# Altium project CHEM_CONTROL_BOX.PrjPcb (part 2 of 3)

## Sheet MCU.SchDoc
size D; SheetNumber: 3; SheetTotal: 7
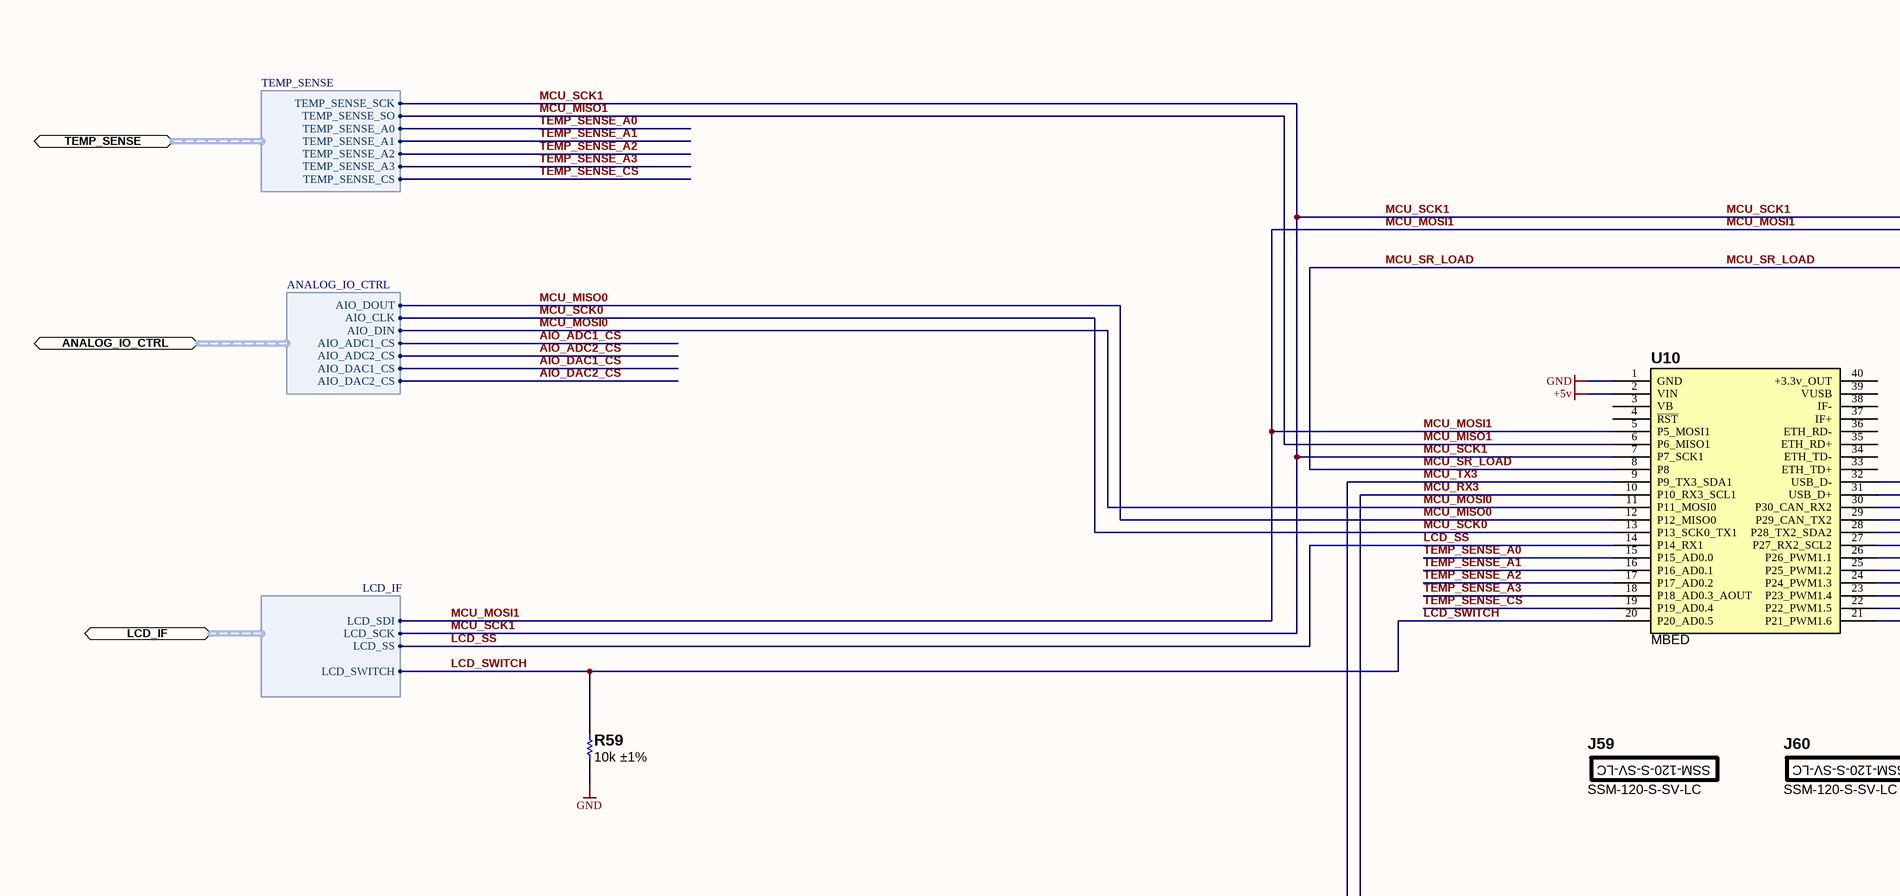
[diagram p12: MCU.SchDoc, top left]
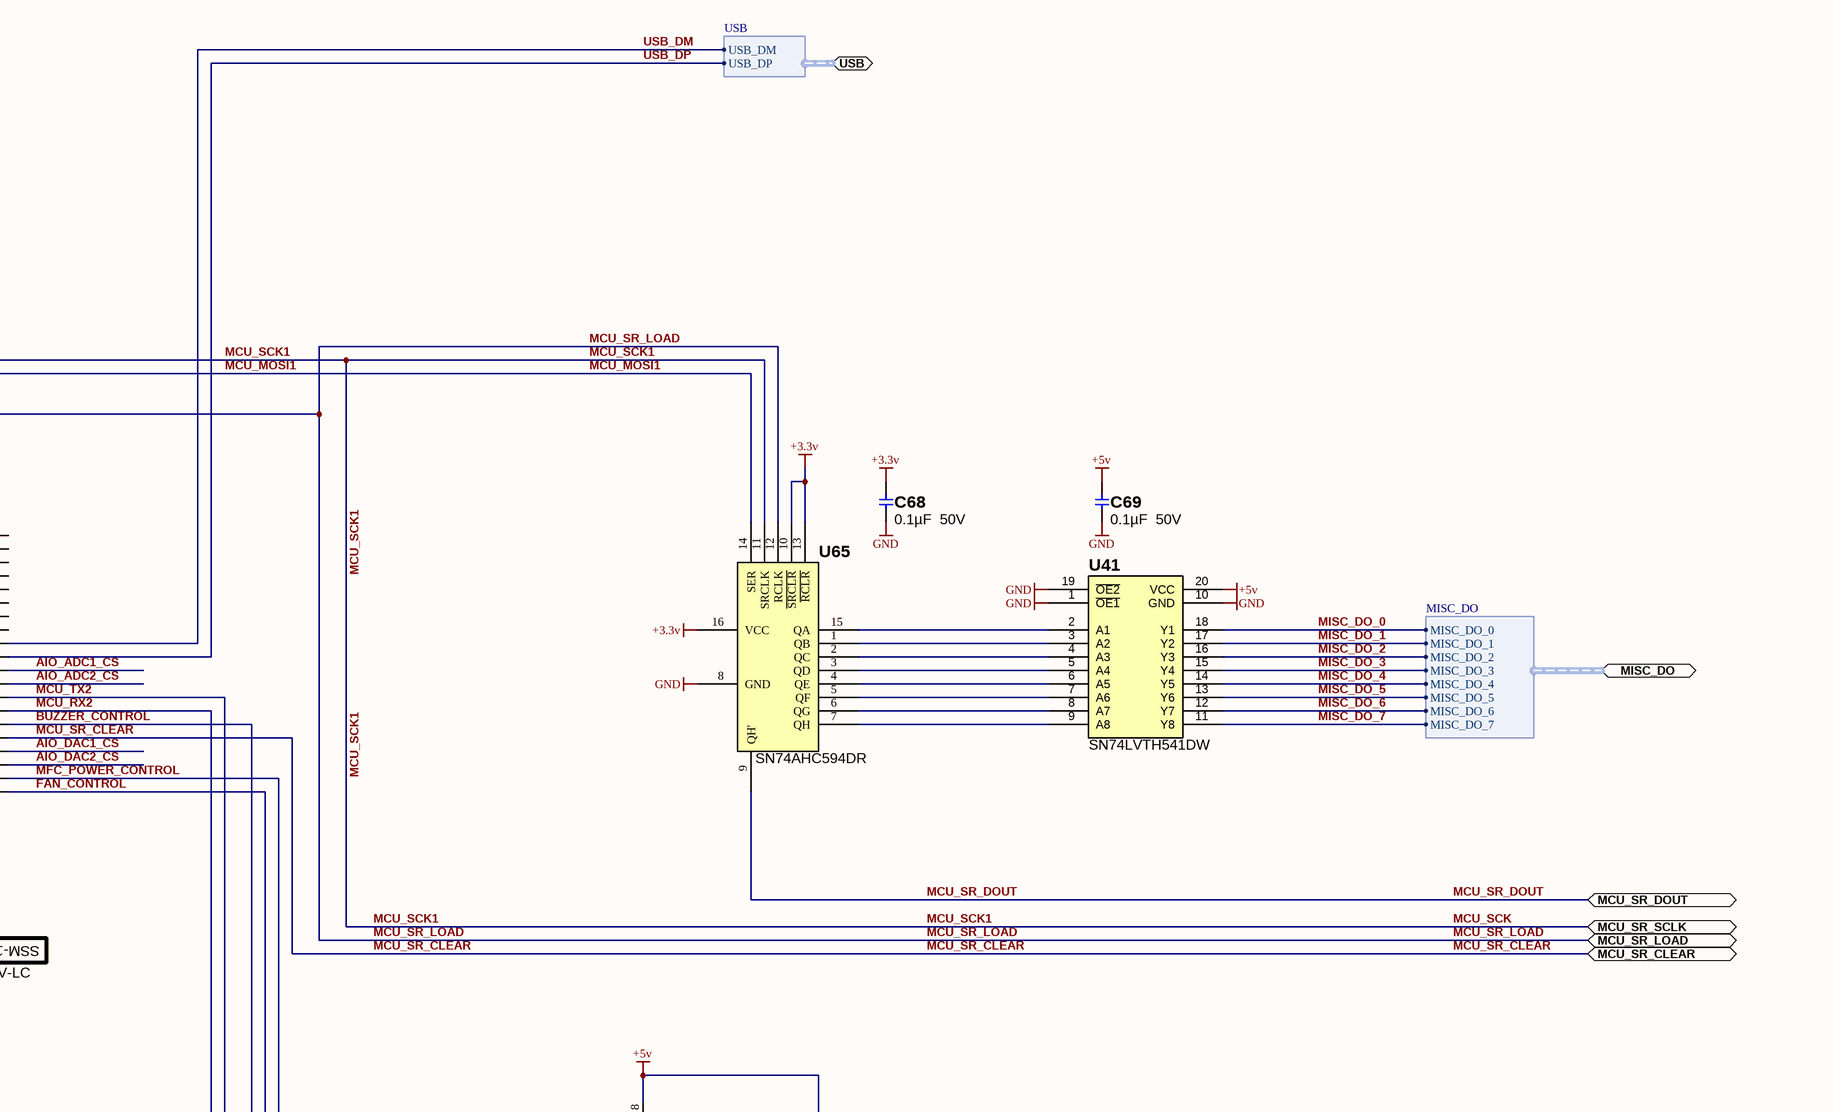
[diagram p13: MCU.SchDoc, top right]
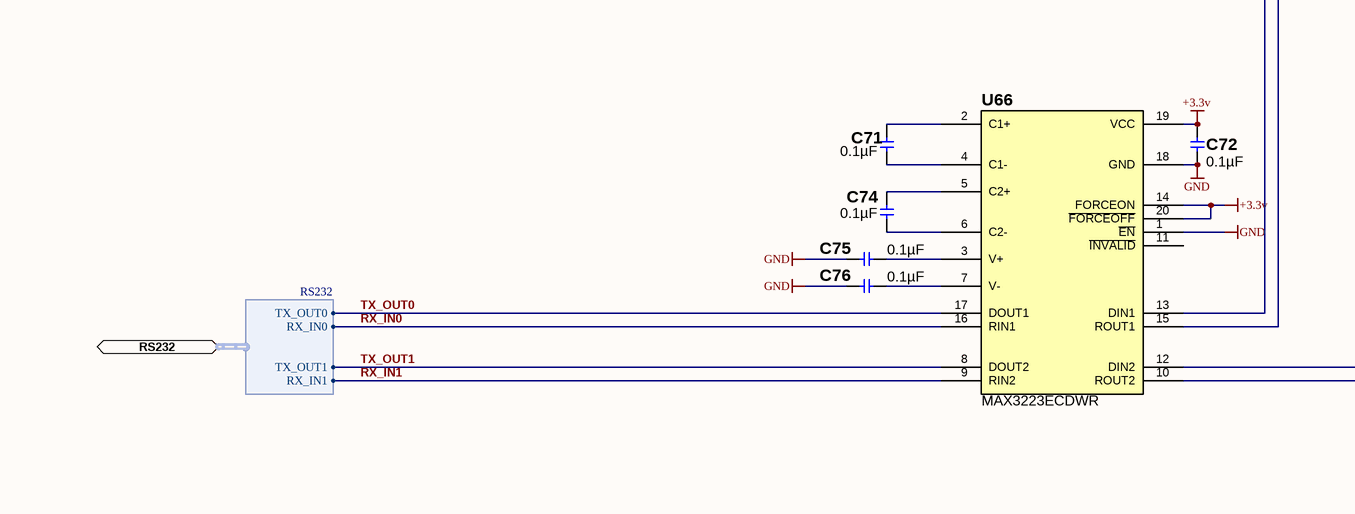
[diagram p14: MCU.SchDoc, bottom left]
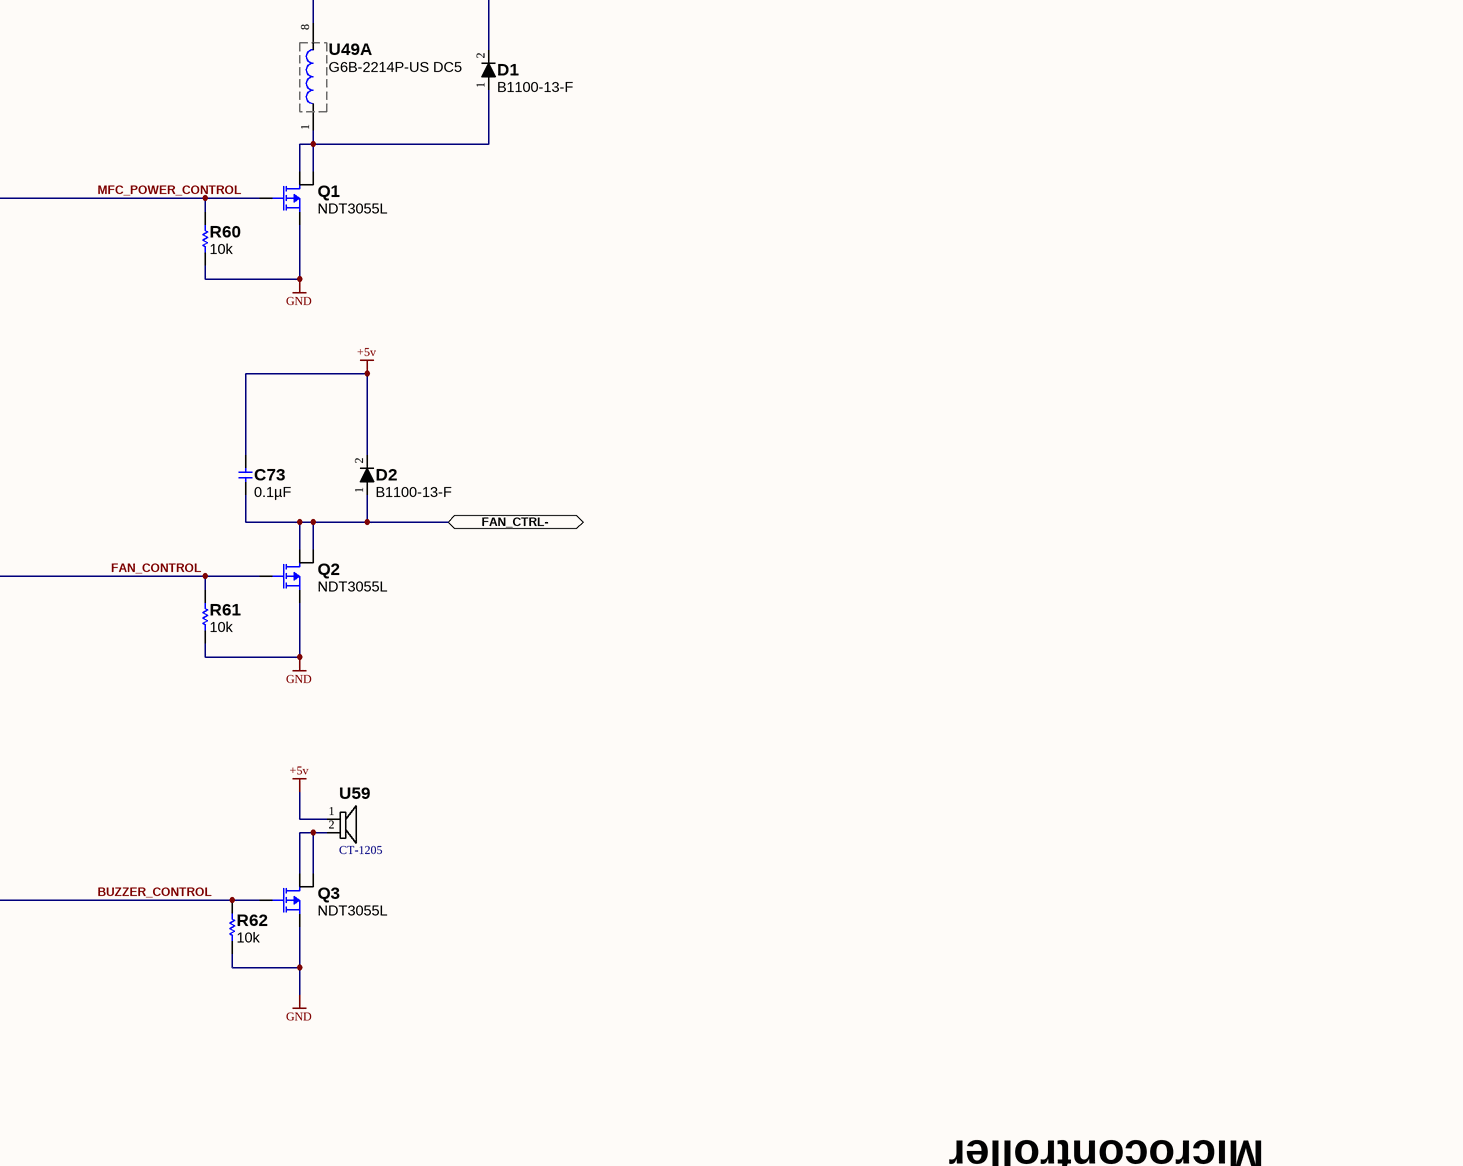
[diagram p15: MCU.SchDoc, bottom right]

### Parts
C68  0.1µF  50V  [C0805_LD]
C69  0.1µF  50V  [C0805_LD]
C71  0.1µF  [C0805_LD]
C72  0.1µF  [C0805_LD]
C73  0.1µF  [C0805_LD]
C74  0.1µF  [C0805_LD]
C75  0.1µF  [C0805_LD]
C76  0.1µF  [C0805_LD]
D1  B1100-13-F  [D_SMA_P]
D2  B1100-13-F  [D_SMA_P]
J59  SSM-120-S-SV-LC  (mechanical)
J60  SSM-120-S-SV-LC  (mechanical)
Q1  NDT3055L  [SOT223]
Q2  NDT3055L  [SOT223]
Q3  NDT3055L  [SOT223]
R59  10k ±1%  [R0805_LD]
R60  10k  [R0805_LD]
R61  10k  [R0805_LD]
R62  10k  [R0805_LD]
U10  MBED  [MBED_SURFACEMOUNT_SOCKET]
U41  SN74LVTH541DW  [SOIC127P1030X265-20L]
U49  G6B-2214P-US DC5  [G6B-2214P-US]  (part A of 2)
U59  CT-1205  [CT-1205]
U65  SN74AHC594DR  [SOIC127P600X145-16L]
U66  MAX3223ECDWR  [SOIC127P1030X265-20L]

### Ports
ANALOG_IO_CTRL (harness ANALOG_IO_CTRL), FAN_CTRL-, LCD_IF (harness LCD_IF), MCU_SR_CLEAR, MCU_SR_DOUT, MCU_SR_LOAD, MCU_SR_SCLK, MISC_DO (harness MISC_DO), RS232 (harness RS232), TEMP_SENSE (harness TEMP_SENSE), USB (harness USB)

### Harnesses
ANALOG_IO_CTRL: AIO_DOUT, AIO_CLK, AIO_DIN, AIO_ADC1_CS, AIO_ADC2_CS, AIO_DAC1_CS, AIO_DAC2_CS
TEMP_SENSE: TEMP_SENSE_SCK, TEMP_SENSE_SO, TEMP_SENSE_A0, TEMP_SENSE_A1, TEMP_SENSE_A2, TEMP_SENSE_A3, TEMP_SENSE_CS
LCD_IF: LCD_SWITCH, LCD_SDI, LCD_SCK, LCD_SS
MISC_DO: MISC_DO_0, MISC_DO_1, MISC_DO_2, MISC_DO_3, MISC_DO_4, MISC_DO_5, MISC_DO_6, MISC_DO_7
RS232: TX_OUT0, RX_IN0, TX_OUT1, RX_IN1
USB: USB_DM, USB_DP

### Nets
+3.3v: C68.2 C72.2 U65.10(~{SRCLR}) U65.13(~{RCLR}) U65.16(VCC) U66.14(FORCEON) U66.19(VCC) U66.20(~{FORCEOFF})
+5v: C69.2 C73.2 D1.2(K) D2.2(K) U10.2(VIN) U41.20(VCC) U49.8 U59.1(+)
GND: C68.1 C69.1 C72.1 C75.1 C76.1 Q1.3(S) Q2.3(S) Q3.3(S) R59.1 R60.1 R61.1 R62.1 U10.1(GND) U41.1(~{OE1}) U41.10(GND) U41.19(~{OE2}) U65.8(GND) U66.1(~{EN}) U66.18(GND)
AIO_ADC1_CS: U10.30(P30_CAN_RX2) ; port ANALOG_IO_CTRL.AIO_ADC1_CS
AIO_ADC2_CS: U10.29(P29_CAN_TX2) ; port ANALOG_IO_CTRL.AIO_ADC2_CS
AIO_DAC1_CS: U10.24(P24_PWM1.3) ; port ANALOG_IO_CTRL.AIO_DAC1_CS
AIO_DAC2_CS: U10.23(P23_PWM1.4) ; port ANALOG_IO_CTRL.AIO_DAC2_CS
BUZZER_CONTROL: Q3.1(G) R62.2 U10.26(P26_PWM1.1)
FAN_CONTROL: Q2.1(G) R61.2 U10.21(P21_PWM1.6)
LCD_SS: U10.14(P14_RX1) ; port LCD_IF.LCD_SS
LCD_SWITCH: R59.2 U10.20(P20_AD0.5) ; port LCD_IF.LCD_SWITCH
MCU_MISO0: U10.12(P12_MISO0) ; port ANALOG_IO_CTRL.AIO_DOUT  [project net AIO_DOUT]
MCU_MISO1: U10.6(P6_MISO1) ; port TEMP_SENSE.TEMP_SENSE_SO
MCU_MOSI0: U10.11(P11_MOSI0) ; port ANALOG_IO_CTRL.AIO_DIN  [project net AIO_DIN]
MCU_MOSI1: U10.5(P5_MOSI1) U65.14(SER) ; port LCD_IF.LCD_SDI  [project net LCD_SDI]
MCU_RX2: U10.27(P27_RX2_SCL2) U66.10(ROUT2)
MCU_RX3: U10.10(P10_RX3_SCL1) U66.15(ROUT1)
MCU_SCK: U10.7(P7_SCK1) U65.11(SRCLK) ; port MCU_SR_SCLK, port TEMP_SENSE.TEMP_SENSE_SCK, port LCD_IF.LCD_SCK  [also labelled MCU_SCK1]  [project net LCD_SCK]
MCU_SCK0: U10.13(P13_SCK0_TX1) ; port ANALOG_IO_CTRL.AIO_CLK  [project net AIO_CLK]
MCU_SR_CLEAR: U10.25(P25_PWM1.2) ; port MCU_SR_CLEAR
MCU_SR_DOUT: U65.9(QH') ; port MCU_SR_DOUT
MCU_SR_LOAD: U10.8(P8) U65.12(RCLK) ; port MCU_SR_LOAD
MCU_TX2: U10.28(P28_TX2_SDA2) U66.12(DIN2)
MCU_TX3: U10.9(P9_TX3_SDA1) U66.13(DIN1)
MFC_POWER_CONTROL: Q1.1(G) R60.2 U10.22(P22_PWM1.5)
MISC_DO_0: U41.18(Y1) ; port MISC_DO.MISC_DO_0
MISC_DO_1: U41.17(Y2) ; port MISC_DO.MISC_DO_1
MISC_DO_2: U41.16(Y3) ; port MISC_DO.MISC_DO_2
MISC_DO_3: U41.15(Y4) ; port MISC_DO.MISC_DO_3
MISC_DO_4: U41.14(Y5) ; port MISC_DO.MISC_DO_4
MISC_DO_5: U41.13(Y6) ; port MISC_DO.MISC_DO_5
MISC_DO_6: U41.12(Y7) ; port MISC_DO.MISC_DO_6
MISC_DO_7: U41.11(Y8) ; port MISC_DO.MISC_DO_7
RX_IN0: U66.16(RIN1) ; port RS232.RX_IN0  [project net RS232_RX_IN_0]
RX_IN1: U66.9(RIN2) ; port RS232.RX_IN1  [project net RS232_RX_IN_1]
TEMP_SENSE_A0: U10.15(P15_AD0.0) ; port TEMP_SENSE.TEMP_SENSE_A0
TEMP_SENSE_A1: U10.16(P16_AD0.1) ; port TEMP_SENSE.TEMP_SENSE_A1
TEMP_SENSE_A2: U10.17(P17_AD0.2) ; port TEMP_SENSE.TEMP_SENSE_A2
TEMP_SENSE_A3: U10.18(P18_AD0.3_AOUT) ; port TEMP_SENSE.TEMP_SENSE_A3
TEMP_SENSE_CS: U10.19(P19_AD0.4) ; port TEMP_SENSE.TEMP_SENSE_CS
TX_OUT0: U66.17(DOUT1) ; port RS232.TX_OUT0  [project net RS232_TX_OUT_0]
TX_OUT1: U66.8(DOUT2) ; port RS232.TX_OUT1  [project net RS232_TX_OUT_1]
USB_DM: U10.32(USB_D-) ; port USB.USB_DM
USB_DP: U10.31(USB_D+) ; port USB.USB_DP
NetC71_1: C71.1 U66.4(C1-)
NetC71_2: C71.2 U66.2(C1+)
NetC73_1: C73.1 D2.1(A) Q2.2(D) Q2.4(D) ; port FAN_CTRL-
NetC74_1: C74.1 U66.6(C2-)
NetC74_2: C74.2 U66.5(C2+)
NetC75_2: C75.2 U66.3(V+)
NetC76_2: C76.2 U66.7(V-)
NetD1_1: D1.1(A) Q1.2(D) Q1.4(D) U49.1
NetQ3_2: Q3.2(D) Q3.4(D) U59.2(-)
NetU41_2: U41.2(A1) U65.15(QA)
NetU41_3: U41.3(A2) U65.1(QB)
NetU41_4: U41.4(A3) U65.2(QC)
NetU41_5: U41.5(A4) U65.3(QD)
NetU41_6: U41.6(A5) U65.4(QE)
NetU41_7: U41.7(A6) U65.5(QF)
NetU41_8: U41.8(A7) U65.6(QG)
NetU41_9: U41.9(A8) U65.7(QH)

Not connected (* = marked no-connect by the designer): U10 3(VB) 4(~{RST}) 33(ETH_TD+) 34(ETH_TD-) 35(ETH_RD+) 36(ETH_RD-) 37(IF+) 38(IF-) 39(VUSB) 40(+3.3v_OUT); U66 11(~{INVALID})

### Notes on the sheet
- Microcontroller
- -1
- Wavenumber LLC
- 2pl
- Rev:
- Sheet
- of

### Library data of the parts
C68 C69 C71-C76 = GRM21BR71H104KA01L: CAP CER 0.1UF 50V 10% X7R 0805; Manufacturer: Murata Electronics North America; Temperature Coefficient: X7R; Manufacturer Part Number: GRM21BR71H104KA01L; ComponentLink1Description: \\altium.sil.arl.psu.edu\Libraries\datasheets\Murata Electronics North America\c02e.pdf; ComponentLink1URL: http://search.murata.co.jp/Ceramy/image/img/A01X/G101/ENG/GRM1555C1HR60WA01-01.pdf; ComponentLink2Description: External Datasheet; ComponentLink2URL: http://www.murata.com/products/catalog/pdf/c02e.pdf; Stocked: 0; Supplier 1: Digi-Key; Supplier Part Number 1: 490-1666-1-ND; Category: Capacitors; Sort Value: 100000; Sort Value Package: 0805_100000; Pricing: 1 = 0.1  ;  10 = 0.046  ;  50 = 0.0248  ;  100 = 0.0209  ;  250 = 0.01712  ;  500 = 0.01464  ;  1000 = 0.0114 (USD); Sales Status: Active; Capacitance: 0.1µF; Voltage - Rated: 50V; Tolerance: ±10%; Mounting Type: Surface Mount- MLCC; Operating Temperature: -55°C ~ 125°C; Applications: General Purpose; Ratings: -; Package / Case: 0805 (2012 Metric); Size / Dimension: 0.079" L x 0.049" W (2.00mm x 1.25mm); Height - Seated (Max): -; Thickness (Max): 0.053" (1.35mm); Lead Spacing: -; Features: -; Packaging: Cut Tape (CT); Lead Style: -; Package: 0805; Thickness: 135
  C68 C69: Value: 0.1µF  50V
  C71-C76: Value: 0.1µF
D1 D2 = B1100-13-F: DIODE SCHOTTKY 100V 1A SMA; Manufacturer: Diodes Inc; CategorySort: 400; Voltage - Forward (Vf) (Max) @ If: 790mV @ 1A; Speed: Fast Recovery =< 500ns- > 200mA (Io); Current - Reverse Leakage @ Vr: 500µA @ 100V; Capacitance @ Vr- F: 80pF @ 4V- 1MHz; Num Pins: 2; Diode Suffix: 1A_2C; Category: Diodes; Value: B1100-13-F; Manufacturer Part Number: B1100-13-F; ComponentLink1Description: Internal Datasheet; ComponentLink1URL: http://www.diodes.com/datasheets/ds30018.pdf; ComponentLink2Description: External Datasheet; ComponentLink2URL: http://www.diodes.com/datasheets/ds30018.pdf; Stocked: -; Supplier 1: Digi-Key; Supplier Part Number 1: B1100-FDICT-ND; SortValue: B1100-13-F; Pricing: 1 = 0.57  ;  10 = 0.4  ;  25 = 0.3288  ;  100 = 0.2627  ;  250 = 0.1914  ;  500 = 0.15544  ;  1000 = 0.11948  ;  2500 = 0.1073 (USD); Sales Status: Active; Diode Type: Schottky; Voltage - DC Reverse (Vr) (Max): 100V; Current - Average Rectified (Io): 1A; Reverse Recovery Time (trr): -; Mounting Type: Surface Mount; Package / Case: DO-214AC- SMA; Supplier Device Package: SMA; Packaging: Cut Tape (CT)
J59 J60 = SSM-120-S-SV-LC (BOM ITEM): SAMTEC - SSM-120-S-SV-LC - .025 SOCKET STRIPS; Supplier 1: Newark; Manufacturer: SAMTEC; Manufacturer Part Number: SSM-120-S-SV-LC; Stock 1: 0; Pricing 1: 1=4.98, 12500=4.38, 25000=4.14 (USD); Supplier Part Number 1: 81P6611
Q1-Q3 = NDT3055L: MOSFET N-CH 60V 4A SOT-223-4; Manufacturer: Fairchild Semiconductor; FET Type: MOSFET N-Channel, Metal Oxide; FET Feature: Logic Level Gate; Rds On (Max) @ Id, Vgs: 100 mOhm @ 4A, 10V; Vgs(th) (Max) @ Id: 2V @ 250µA; Gate Charge (Qg) @ Vgs: 20nC @ 10V; Input Capacitance (Ciss) @ Vds: 345pF @ 25V; Power - Max: 1.1W; Value: NDT3055L; Supplier 1: Digi-Key; Manufacturer Part Number: NDT3055L; RoHS: RoHS Compliant; Category: Discrete Semiconductor Products; Stock 1: 18949; Pricing 1: 1=0.69, 10=0.599, 100=0.4725, 250=0.40952, 500=0.3465, 750=0.29925, 1000=0.27563, 2000=0.252 (USD); Drain to Source Voltage (Vdss): 60V; Current - Continuous Drain (Id) @ 25° C: 4A; Mounting Type: Surface Mount; Package / Case: TO-261-4, TO-261AA; Packaging: Cut Tape (CT); Supplier Device Package: SOT-223-3; ComponentLink1URL: http://www.fairchildsemi.com/ds/ND/NDT3055L.pdf; ComponentLink1Description: http://www.fairchildsemi.com/ds/ND/NDT3055L.pdf; Supplier Part Number 1: NDT3055LCT-ND
R59-R62 = ERJ-6ENF1002V: RES 10K OHM 1/8W 1% 0805 SMD; Manufacturer: Panasonic Electronic Components; Package Power: 0805  (0.125W); Power (Watts): 0.125W- 1/8W; Temperature Coefficient: ±100ppm/°C; Limiting Element Voltage: 150; Maximum Overload Voltage: 200; Maximum Working Voltage: 35.4V; Manufacturer Part Number: ERJ-6ENF1002V; ComponentLink1Description: Internal Datasheet; ComponentLink1URL: \\altium.sil.arl.psu.edu\Libraries\datasheets\Panasonic Electronic Components\AOA0000CE2.pdf; ComponentLink2Description: External Datasheet; ComponentLink2URL: http://industrial.panasonic.com/www-data/pdf/AOA0000/AOA0000CE2.pdf; Stocked: 0; Supplier 1: Digi-Key; Supplier Part Number 1: P10.0KCCT-ND; Category: Resistors; Resistance (Ohms): 10k; Composition: Thick Film; Features: -; Tolerance: ±1%; Package / Case: 0805 (2012 Metric); Footprint: 805; Size / Dimension: 0.079" L x 0.049" W (2.00mm x 1.25mm); Height: 0.028" (0.70mm); Number of Terminations: 2; Packaging: Cut Tape (CT); Sort Value: 10000; Sort Value Package: 805_10000
  R59: Value: 10k ±1%
  R60-R62: Value: 10k
U10 = OM11043: DEVELOPMENT BOARD LPC1768 MBED; Manufacturer: NXP Semiconductors; Contents: Board and software; Value: MBED; Supplier 1: Digi-Key; Supplier Part Number 1: 568-4916-ND; Manufacturer Part Number: OM11043; RoHS: RoHS Compliant; Category: Programmers, Development Systems; Stock 1: 376; Pricing 1: 1=59 (USD); Type: MCU; For Use With/Related Products: LPC1768; ComponentLink1URL: http://ics.nxp.com/products/lpc1000/datasheet/lpc1763.lpc1764.lpc1765.lpc1766.lpc1767.lpc1768.lpc1769.pdf; ComponentLink1Description: http://ics.nxp.com/products/lpc1000/datasheet/lpc1763.lpc1764.lpc1765.lpc1766.lpc1767.lpc1768.lpc1769.pdf
U41 = SN74LVTH541DW: IC BUFF/DVR TRI-ST 8BIT 20SOIC; Manufacturer: Texas Instruments; Logic Type: Buffer/Line Driver, Non-Inverting; Number of Elements: 1; Number of Bits per Element: 8; Current - Output High, Low: 32mA, 64mA; Voltage - Supply: 2.7 V ~ 3.6 V; Value: SN74LVTH541DW; Supplier 1: Digi-Key; Supplier Part Number 1: 296-8728-5-ND; Manufacturer Part Number: SN74LVTH541DW; RoHS: RoHS Compliant; Category: Integrated Circuits (ICs); Stock 1: 8053; Pricing 1: 1=2.02, 25=1.6252, 100=1.4625, 250=1.3, 500=1.1375, 1000=0.9425, 2500=0.8775, 5000=0.845, 10000=0.8125 (USD); Packaging: Tube; Operating Temperature: -40°C ~ 85°C; Mounting Type: Surface Mount; Package / Case: 20-SOIC (0.295", 7.50mm Width); Supplier Device Package: 20-SOIC; ComponentLink1URL: http://www.ti.com/lit/ds/symlink/sn74lvth541.pdf; ComponentLink1Description: http://www.ti.com/lit/ds/symlink/sn74lvth541.pdf
U49 = G6B-2214P-US DC5: RELAY GENERAL PURPOSE DPST 5A 5V; Manufacturer: Omron Electronics Inc-EMC Div; Coil Type: Non Latching; Coil Current: 60mA; Coil Voltage: 5VDC; Contact Form: DPST (2 Form A); Switching Voltage: 380VAC, 125VDC - Max; Turn On Voltage (Max): 4 VDC; Turn Off Voltage (Min): 0.5 VDC; Operate Time: 10ms; Coil Power: 300 mW; Coil Resistance: 83.3 Ohms; Value: G6B-2214P-US DC5; Supplier 1: Digi-Key; Supplier Part Number 1: Z947-ND; Manufacturer Part Number: G6B-2214P-US DC5; RoHS: RoHS Compliant; Category: Relays; Stock 1: 2840; Pricing 1: 1=7.27, 10=6.816, 25=6.0584, 50=5.7556, 100=5.4526, 250=4.84676, 500=4.54384, 1000=4.24092, 2500=4.16519 (USD); Packaging: Bulk; Relay Type: General Purpose; Contact Rating (Current): 5A; Release Time: 10ms; Features: Sealed - Fully; Mounting Type: Through Hole; Termination Style: PC Pin; Contact Material: Silver Alloy, Cadmium Free; Operating Temperature: -25°C ~ 70°C; ComponentLink1URL: http://www.components.omron.com/components/web/PDFLIB.nsf/0/4287C4A29AD8E88785257201007DD690/$file/G6B_0911.pdf; ComponentLink1Description: http://www.components.omron.com/components/web/PDFLIB.nsf/0/4287C4A29AD8E88785257201007DD690/$file/G6B_0911.pdf
U59 = CT-1205: Source Part Number: 102-1199-2-ND; Manufacturer: CUI Inc; Driver Circuitry: Transducer, Externally Driven; Input Type: zero-peak Signal; Voltage - Rated: 5Vo-p; Voltage Range: 3 ~ 8V; Frequency: 2.4kHz; Operating Mode: Continuous; Sound Pressure Level: 87dB @ 5V, 10cm; Current - Supply: 40mA; Washable: Yes; Source: Digikey; Manufacturer Part Number: CT-1205; ROHS Certificate: *; Supplier 1: Digi-Key; Supplier Part Number 1: 102-1199-6-ND; RoHS: RoHS Compliant; Category: Audio Products; Stock 1: 10608; Pricing 1: 1=2.68, 10=2.222, 100=1.6456 (USD); Packaging: Digi-Reel®; Technology: Magnetic; Mounting Type: Surface Mount; Termination: Solder Pads; Size / Dimension: Square - 12.80mm L x 12.80mm W x 7.60mm H; Capacitance @ Frequency: -; Operating Temperature: -30°C ~ 85°C; ComponentLink1URL: http://www.cui.com/product/resource/digikeypdf/ct-1205-smt.pdf; ComponentLink1Description: http://www.cui.com/product/resource/digikeypdf/ct-1205-smt.pdf; Value: CT-1205
U65 = SN74AHC594DR: IC SHIFT REGISTER 8BIT 16-SOIC; Manufacturer: Texas Instruments; Output Type: Standard; Number of Elements: 1; Number of Bits per Element: 8; Function: Serial to Parallel; Voltage - Supply: 2 V ~ 5.5 V; Supplier 1: Digi-Key; Manufacturer Part Number: SN74AHC594DR; RoHS: RoHS Compliant; Category: Integrated Circuits (ICs); Stock 1: 1808; Pricing 1: 1=0.59, 10=0.494, 25=0.4332, 100=0.3708, 250=0.3216, 500=0.2724, 1000=0.21 (USD); Packaging: Cut Tape (CT); Logic Type: Shift Register; Operating Temperature: -40°C ~ 85°C; Mounting Type: Surface Mount; Package / Case: 16-SOIC (0.154", 3.90mm Width); Supplier Device Package: 16-SOIC N; ComponentLink1URL: http://www.ti.com/lit/ds/symlink/sn74ahc594.pdf; ComponentLink1Description: http://www.ti.com/lit/ds/symlink/sn74ahc594.pdf; Supplier Part Number 1: 296-31743-1-ND; Value: SN74AHC594DR
U66 = MAX3223ECDWR: IC RS232 3V5.5V DRVR ESD 20-SOIC; Manufacturer: Texas Instruments; Number of Drivers/Receivers: 2/2; Duplex: Full; Receiver Hysteresis: 500mV; Data Rate: 500kbps; Voltage - Supply: 3 V ~ 5.5 V; Value: MAX3223ECDWR; Supplier 1: Digi-Key; Supplier Part Number 1: 296-19839-1-ND; Manufacturer Part Number: MAX3223ECDWR; RoHS: RoHS Compliant; Category: Integrated Circuits (ICs); Stock 1: 2550; Pricing 1: 1=2.23, 10=2.016, 25=1.806, 100=1.624, 250=1.442, 500=1.26, 1000=1.043 (USD); Packaging: Cut Tape (CT); Type: Transceiver; Protocol: RS232; Operating Temperature: 0°C ~ 70°C; Mounting Type: Surface Mount; Package / Case: 20-SOIC (0.295", 7.50mm Width); Supplier Device Package: 20-SOIC; ComponentLink1URL: http://www.ti.com/lit/ds/symlink/max3223e.pdf; ComponentLink1Description: http://www.ti.com/lit/ds/symlink/max3223e.pdf

## Sheet POWER_SUPPLY.SchDoc
size D; SheetNumber: 6; SheetTotal: 7
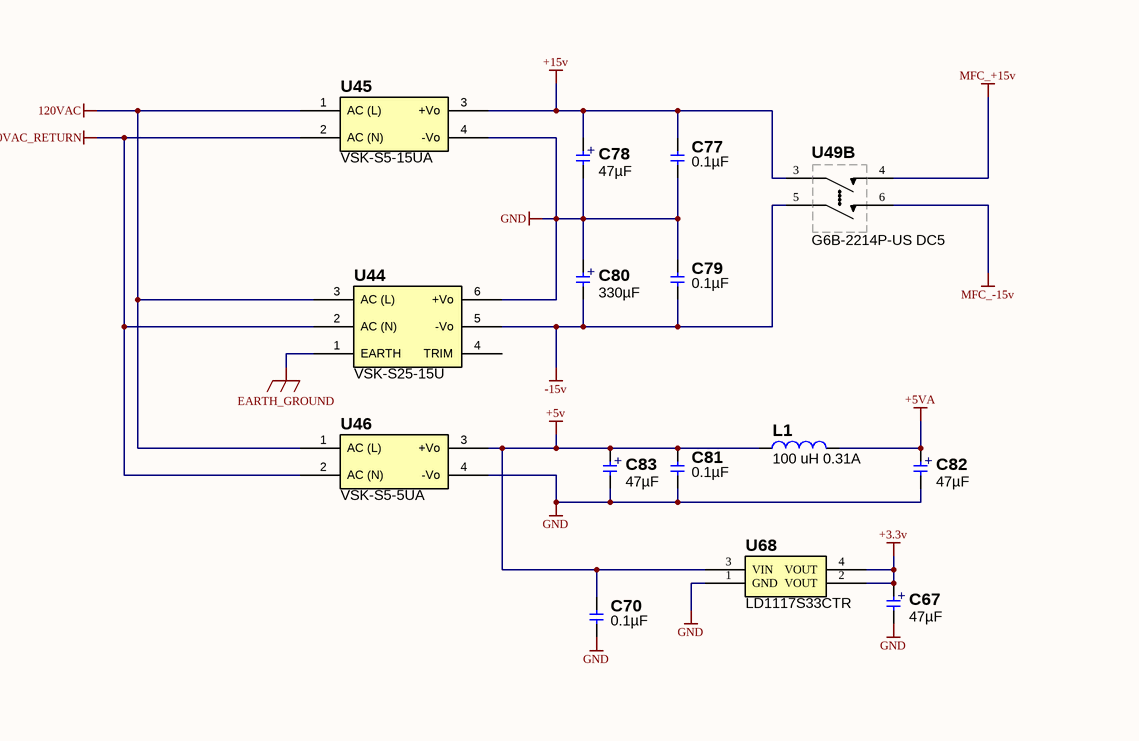
[diagram p16: POWER_SUPPLY.SchDoc, left]
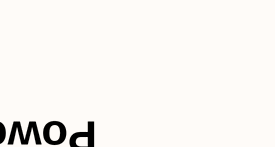
[diagram p17: POWER_SUPPLY.SchDoc, right]

### Parts
C67  47µF  [C_ALU_D]
C70  0.1µF  [C0805_LD]
C77  0.1µF  [C0805_LD]
C78  47µF  [C_ALU_D]
C79  0.1µF  [C0805_LD]
C80  330µF  [C_ALU_F]
C81  0.1µF  [C0805_LD]
C82  47µF  [C_ALU_D]
C83  47µF  [C_ALU_D]
L1  100 uH 0.31A  [L_DO1608C]
U44  VSK-S25-15U  [VSK-S25]
U45  VSK-S5-15UA  [VSK-S5]
U46  VSK-S5-5UA  [VSK-S5]
U49  G6B-2214P-US DC5  [G6B-2214P-US]  (part B of 2)
U68  LD1117S33CTR  [SOT223]

### Nets
120VAC: U44.3(AC_(L)) U45.1(AC_(L)) U46.1(AC_(L))
120VAC_RETURN: U44.2(AC_(N)) U45.2(AC_(N)) U46.2(AC_(N))
+3.3v: C67.1 U68.2(VOUT) U68.4(VOUT)
+5v: C70.2 C81.2 C83.1 L1.1 U46.3(+Vo) U68.3(VIN)
+5VA: C82.1 L1.2
+15v: C77.2 C78.1 U45.3(+Vo) U49.3
-15v: C79.1 C80.2 U44.5(-Vo) U49.5
EARTH_GROUND: U44.1(EARTH)
GND: C67.2 C70.1 C77.1 C78.2 C79.2 C80.1 C81.1 C82.2 C83.2 U44.6(+Vo) U45.4(-Vo) U46.4(-Vo) U68.1(GND)
MFC_+15v: U49.4
MFC_-15v: U49.6

Not connected (* = marked no-connect by the designer): U44 4(TRIM)

### Notes on the sheet
- Power Supply
- -1
- Wavenumber LLC
- 2pl
- Rev:
- Sheet
- of
- (in symbol EEE-FK1E331P) +
- (in symbol EEE-FK1E470P) +

### Library data of the parts
C67 C78 C82 C83 = EEE-FK1E470P: CAP ALUM 47UF 25V 20% SMD; Manufacturer: Panasonic Electronic Components; Lifetime @ Temp#: 2000 Hrs @ 105°C; Ripple Current: 240mA; Impedance: 360 mOhm; Surface Mount Land Size: 0.260" L x 0.260" W (6.60mm x 6.60mm); F40: 0P; Value: 47µF; Temperature Coefficient: Temperature Coefficient; Manufacturer Part Number: EEE-FK1E470P; ComponentLink1Description: Internal Datasheet; ComponentLink1URL: http://industrial.panasonic.com/www-cgi/jvcr13pz.cgi?E+PZ+3+ABA0120+EEEFK1E470P+7+WW; ComponentLink2Description: External Datasheet; ComponentLink2URL: http://industrial.panasonic.com/www-cgi/jvcr13pz.cgi?E+PZ+3+ABA0120+EEEFK1E470P+7+WW; Stocked: 0; Supplier 1: Digi-Key; Supplier Part Number 1: PCE3804CT-ND; Category: Capacitors; SortValue: 47000000; Sort Value Package: D_47000000; Pricing: 1 = 0.56  ;  50 = 0.3364  ;  100 = 0.2944  ;  250 = 0.23132  ;  500 = 0.2103 (USD); Sales Status: Active; Capacitance: 47µF; Voltage Rating: 25V; Tolerance: ±20%; Operating Temperature: -55°C ~ 105°C; Features: General Purpose; ESR (Equivalent Series Resistance): -; Mounting Type: Surface Mount; Package / Case: Radial- Can - SMD; Size / Dimension: 0.248" Dia (6.30mm); Height - Seated (Max): 0.228" (5.80mm); Lead Spacing: -; Packaging: Cut Tape (CT); Diameter: 6.30; Height: 5.80; Package: D
C70 C77 C79 C81 = GRM21BR71H104KA01L: as C68 on sheet MCU; Value: 0.1µF; Temperature Coefficient: X7R; Manufacturer Part Number: GRM21BR71H104KA01L; ComponentLink1Description: \\altium.sil.arl.psu.edu\Libraries\datasheets\Murata Electronics North America\c02e.pdf; ComponentLink1URL: http://search.murata.co.jp/Ceramy/image/img/A01X/G101/ENG/GRM1555C1HR60WA01-01.pdf; ComponentLink2Description: External Datasheet; ComponentLink2URL: http://www.murata.com/products/catalog/pdf/c02e.pdf; Stocked: 0; Supplier 1: Digi-Key; Supplier Part Number 1: 490-1666-1-ND; Category: Capacitors; Sort Value: 100000; Sort Value Package: 0805_100000; Pricing: 1 = 0.1  ;  10 = 0.046  ;  50 = 0.0248  ;  100 = 0.0209  ;  250 = 0.01712  ;  500 = 0.01464  ;  1000 = 0.0114 (USD); Sales Status: Active; Capacitance: 0.1µF; Voltage - Rated: 50V; Tolerance: ±10%; Mounting Type: Surface Mount- MLCC; Operating Temperature: -55°C ~ 125°C; Applications: General Purpose; Ratings: -; Package / Case: 0805 (2012 Metric); Size / Dimension: 0.079" L x 0.049" W (2.00mm x 1.25mm); Height - Seated (Max): -; Thickness (Max): 0.053" (1.35mm); Lead Spacing: -; Features: -; Packaging: Cut Tape (CT); Lead Style: -; Package: 0805; Thickness: 135
C80 = EEE-FK1E331P: CAP ALUM 330UF 25V 20% SMD; Manufacturer: Panasonic Electronic Components; Lifetime @ Temp#: 2000 Hrs @ 105°C; Ripple Current: 600mA; Impedance: 160 mOhm; Surface Mount Land Size: 0.327" L x 0.327" W (8.30mm x 8.30mm); F40: 1P; Value: 330µF; Temperature Coefficient: Temperature Coefficient; Manufacturer Part Number: EEE-FK1E331P; ComponentLink1Description: Internal Datasheet; ComponentLink1URL: http://industrial.panasonic.com/www-cgi/jvcr13pz.cgi?E+PZ+3+ABA0120+EEEFK1E331P+7+WW; ComponentLink2Description: External Datasheet; ComponentLink2URL: http://industrial.panasonic.com/www-cgi/jvcr13pz.cgi?E+PZ+3+ABA0120+EEEFK1E331P+7+WW; Stocked: 0; Supplier 1: Digi-Key; Supplier Part Number 1: PCE3803CT-ND; Category: Capacitors; SortValue: 330000000; Sort Value Package: F_330000000; Pricing: 1 = 0.93  ;  50 = 0.5948  ;  100 = 0.5353  ;  250 = 0.46096 (USD); Sales Status: Active; Capacitance: 330µF; Voltage Rating: 25V; Tolerance: ±20%; Operating Temperature: -55°C ~ 105°C; Features: General Purpose; ESR (Equivalent Series Resistance): -; Mounting Type: Surface Mount; Package / Case: Radial- Can - SMD; Size / Dimension: 0.315" Dia (8.00mm); Height - Seated (Max): 0.402" (10.20mm); Lead Spacing: -; Packaging: Cut Tape (CT); Diameter: 8.00; Height: 10.20; Package: F
L1 = DO1608C-104_L: Manufacturer: Coilcraft; Part Number: DO1608C-104_L_; CategorySort: 300; Inductance (uH): 100; DCR Max (Ohms): 1.27; SRF typ (MHz): 9; Isat (A): 0.31; IRMS (A) 20 rise: 0.37; IRMS (A) 40 rise: 0.5; Shielding: Unshielded; Category: Inductors; Value: 100 uH 0.31A; Manufacturer Part Number: DO1608C-104_L; ComponentLink1Description: Internal Datasheet; ComponentLink1URL: http://www.coilcraft.com/pdf_viewer/showpdf.cfm?f=pdf_store:do1608c.pdf; ComponentLink2Description: External Datasheet; ComponentLink2URL: http://www.coilcraft.com/pdf_viewer/showpdf.cfm?f=pdf_store:do1608c.pdf; Stocked: 0; Sort Value: 100; Sort Value Package: DO1608C_100; Supplier 1: Coilcraft; Supplier Part Number 1: DO1608C-104_L; Supplier Unit Price 1: 0.88; Package: DO1608C; Height (mm): 2.92
U44 = VSK-S25-15U: CONV AC/DC 25W 15V 1.6A PCB; Manufacturer: CUI Inc; Number of Outputs: 1; Voltage - Input: 85 ~ 264 VAC; Power Supply Type: Switching (Closed Frame); Efficiency: 83%; Power (Watts) - Max: 24W; Line Regulation: ±0.5%; Load Regulation: ±1%; Approvals: CE, cULus, EN, IEC; Value: VSK-S25-15U; Supplier 1: Digi-Key; Supplier Part Number 1: 102-2413-ND; Manufacturer Part Number: VSK-S25-15U; RoHS: RoHS Compliant; Category: Power Supplies - Board Mount; Stock 1: 77; Pricing 1: 1=33.85, 5=32.852, 10=31.856, 50=29.865, 100=28.8695, 250=27.874, 500=27.37626 (USD); Voltage - Output 1: 15V; Voltage - Output 2: -; Voltage - Output 3: -; Voltage - Output 4: -; Current - Output (Max): 1.6A; Power (Watts): 25W; Applications: Commercial; Features: OCP, OTP, OVP, SCP; Operating Temperature: -25°C ~ 70°C; Mounting Type: Through Hole; Size / Dimension: 2.75" L x 1.89" W x 0.94" H (70.0mm x 48.0mm x 24.0mm); Weight: 0.265 lb (120.2g); ComponentLink1URL: http://www.cui.com/Product/Resource/DigiKeyPDF/VSK-S25.pdf; ComponentLink1Description: http://www.cui.com/Product/Resource/DigiKeyPDF/VSK-S25.pdf
U45 = VSK-S5-15UA: CONV AC/DC 5W 15V 0.33A PCB; Manufacturer: CUI Inc; Number of Outputs: 1; Voltage - Input: 85 ~ 264 VAC; Current - Output (Max): 330mA; Power Supply Type: Switching (Closed Frame); Efficiency: 76%; Line Regulation: ±0.5%; Load Regulation: ±1%; Approvals: CE, cULus, EN; Value: VSK-S5-15UA; Supplier 1: Digi-Key; Supplier Part Number 1: 102-2389-ND; Manufacturer Part Number: VSK-S5-15UA; RoHS: RoHS Compliant; Category: Power Supplies - Board Mount; Stock 1: 248; Pricing 1: 1=16.33, 5=16.094, 10=15.861, 50=14.4616, 100=13.995, 250=13.52852, 500=13.062 (USD); Voltage - Output 1: 15V; Voltage - Output 2: -; Voltage - Output 3: -; Voltage - Output 4: -; Power (Watts): 5W; Applications: Commercial; Features: OTP, OVP, SCP; Operating Temperature: -25°C ~ 70°C; Mounting Type: Through Hole; Size / Dimension: 2.00" L x 1.00" W x 0.62" H (50.8mm x 25.4mm x 15.7mm); Power (Watts) - Max: 5W; Weight: 0.077 lb (34.93g); ComponentLink1URL: http://www.cui.com/Product/Resource/DigiKeyPDF/VSK-S5_Series.pdf; ComponentLink1Description: http://www.cui.com/Product/Resource/DigiKeyPDF/VSK-S5_Series.pdf
U46 = VSK-S5-5UA: CONV AC/DC 5W 5V 1A PCB; Manufacturer: CUI Inc; Number of Outputs: 1; Voltage - Input: 85 ~ 264 VAC; Power Supply Type: Switching (Closed Frame); Efficiency: 72%; Line Regulation: ±0.5%; Load Regulation: ±1%; Approvals: CE, cULus, EN; Value: VSK-S5-5UA; Supplier 1: Digi-Key; Supplier Part Number 1: 102-2386-ND; Manufacturer Part Number: VSK-S5-5UA; RoHS: RoHS Compliant; Category: Power Supplies - Board Mount; Stock 1: 1594; Pricing 1: 1=16.33, 5=16.094, 10=15.861, 50=14.4616, 100=13.995, 250=13.52852, 500=13.062 (USD); Voltage - Output 1: 5V; Voltage - Output 2: -; Voltage - Output 3: -; Voltage - Output 4: -; Current - Output (Max): 1A; Power (Watts): 5W; Applications: Commercial; Features: OTP, OVP, SCP; Operating Temperature: -25°C ~ 70°C; Mounting Type: Through Hole; Size / Dimension: 2.00" L x 1.00" W x 0.62" H (50.8mm x 25.4mm x 15.7mm); Power (Watts) - Max: 5W; Weight: 0.077 lb (34.93g); ComponentLink1URL: http://www.cui.com/Product/Resource/DigiKeyPDF/VSK-S5_Series.pdf; ComponentLink1Description: http://www.cui.com/Product/Resource/DigiKeyPDF/VSK-S5_Series.pdf
U49 = G6B-2214P-US DC5: as U49 on sheet MCU; Value: G6B-2214P-US DC5; Supplier 1: Digi-Key; Supplier Part Number 1: Z947-ND; Manufacturer Part Number: G6B-2214P-US DC5; RoHS: RoHS Compliant; Category: Relays; Stock 1: 2840; Pricing 1: 1=7.27, 10=6.816, 25=6.0584, 50=5.7556, 100=5.4526, 250=4.84676, 500=4.54384, 1000=4.24092, 2500=4.16519 (USD); Packaging: Bulk; Relay Type: General Purpose; Contact Rating (Current): 5A; Release Time: 10ms; Features: Sealed - Fully; Mounting Type: Through Hole; Termination Style: PC Pin; Contact Material: Silver Alloy, Cadmium Free; Operating Temperature: -25°C ~ 70°C; ComponentLink1URL: http://www.components.omron.com/components/web/PDFLIB.nsf/0/4287C4A29AD8E88785257201007DD690/$file/G6B_0911.pdf; ComponentLink1Description: http://www.components.omron.com/components/web/PDFLIB.nsf/0/4287C4A29AD8E88785257201007DD690/$file/G6B_0911.pdf
U68 = LD1117S33CTR: IC REG LDO 3.3V 950MA SOT-223; Manufacturer: STMicroelectronics; Regulator Topology: Positive Fixed; Voltage - Input: Up to 15V; Voltage - Dropout (Typical): 1.1V @ 800mA; Number of Regulators: 1; Supplier 1: Digi-Key; Supplier Part Number 1: 497-1241-1-ND; Manufacturer Part Number: LD1117S33CTR; RoHS: RoHS Compliant; Category: Integrated Circuits (ICs); Stock 1: 20460; Pricing 1: 1=0.54, 10=0.436, 100=0.3267, 250=0.28216, 500=0.24256, 1000=0.1881 (USD); Voltage - Output: 3.3V; Current - Output: 950mA; Current - Limit (Min): -; Operating Temperature: -40°C ~ 125°C; Mounting Type: Surface Mount; Package / Case: TO-261-4, TO-261AA; Supplier Device Package: SOT-223; Packaging: Cut Tape (CT); ComponentLink1URL: http://www.st.com/internet/com/TECHNICAL_RESOURCES/TECHNICAL_LITERATURE/DATASHEET/CD00000544.pdf; ComponentLink1Description: http://www.st.com/internet/com/TECHNICAL_RESOURCES/TECHNICAL_LITERATURE/DATASHEET/CD00000544.pdf; value: LD1117S33CTR

## Sheet TEMPERATURE_MEASUREMENT.SchDoc
size D; SheetNumber: 2; SheetTotal: 7
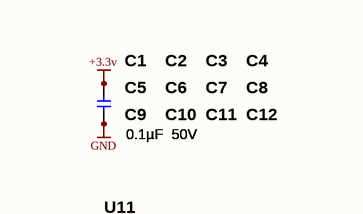
[diagram p18: TEMPERATURE_MEASUREMENT.SchDoc, top left]
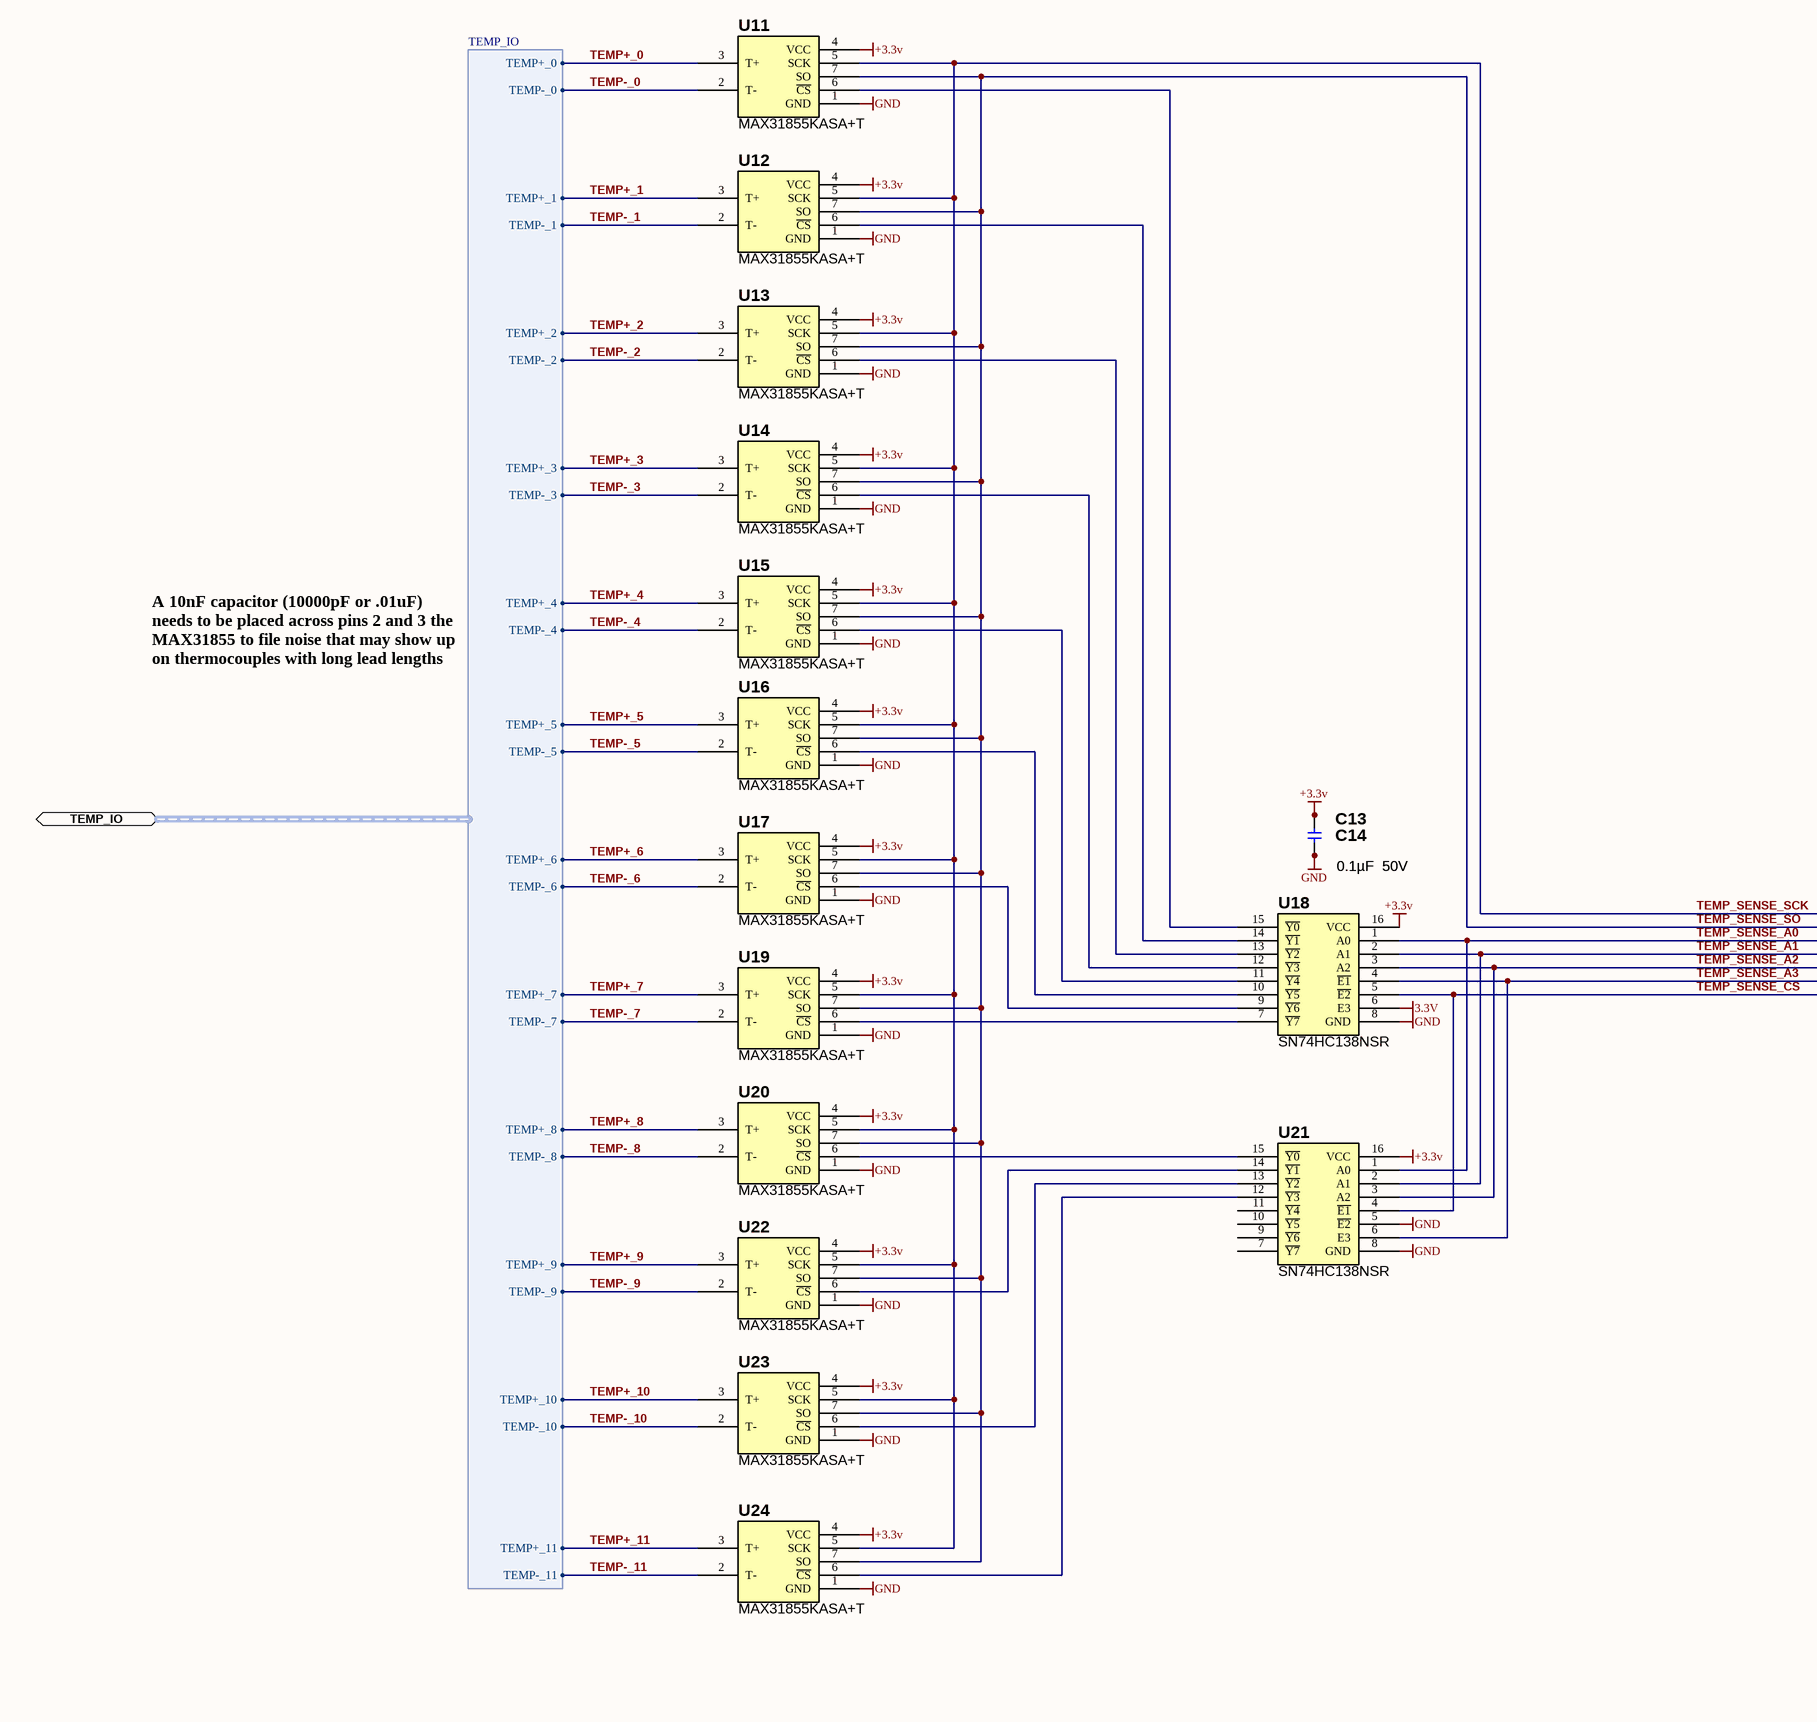
[diagram p19: TEMPERATURE_MEASUREMENT.SchDoc, bottom left]
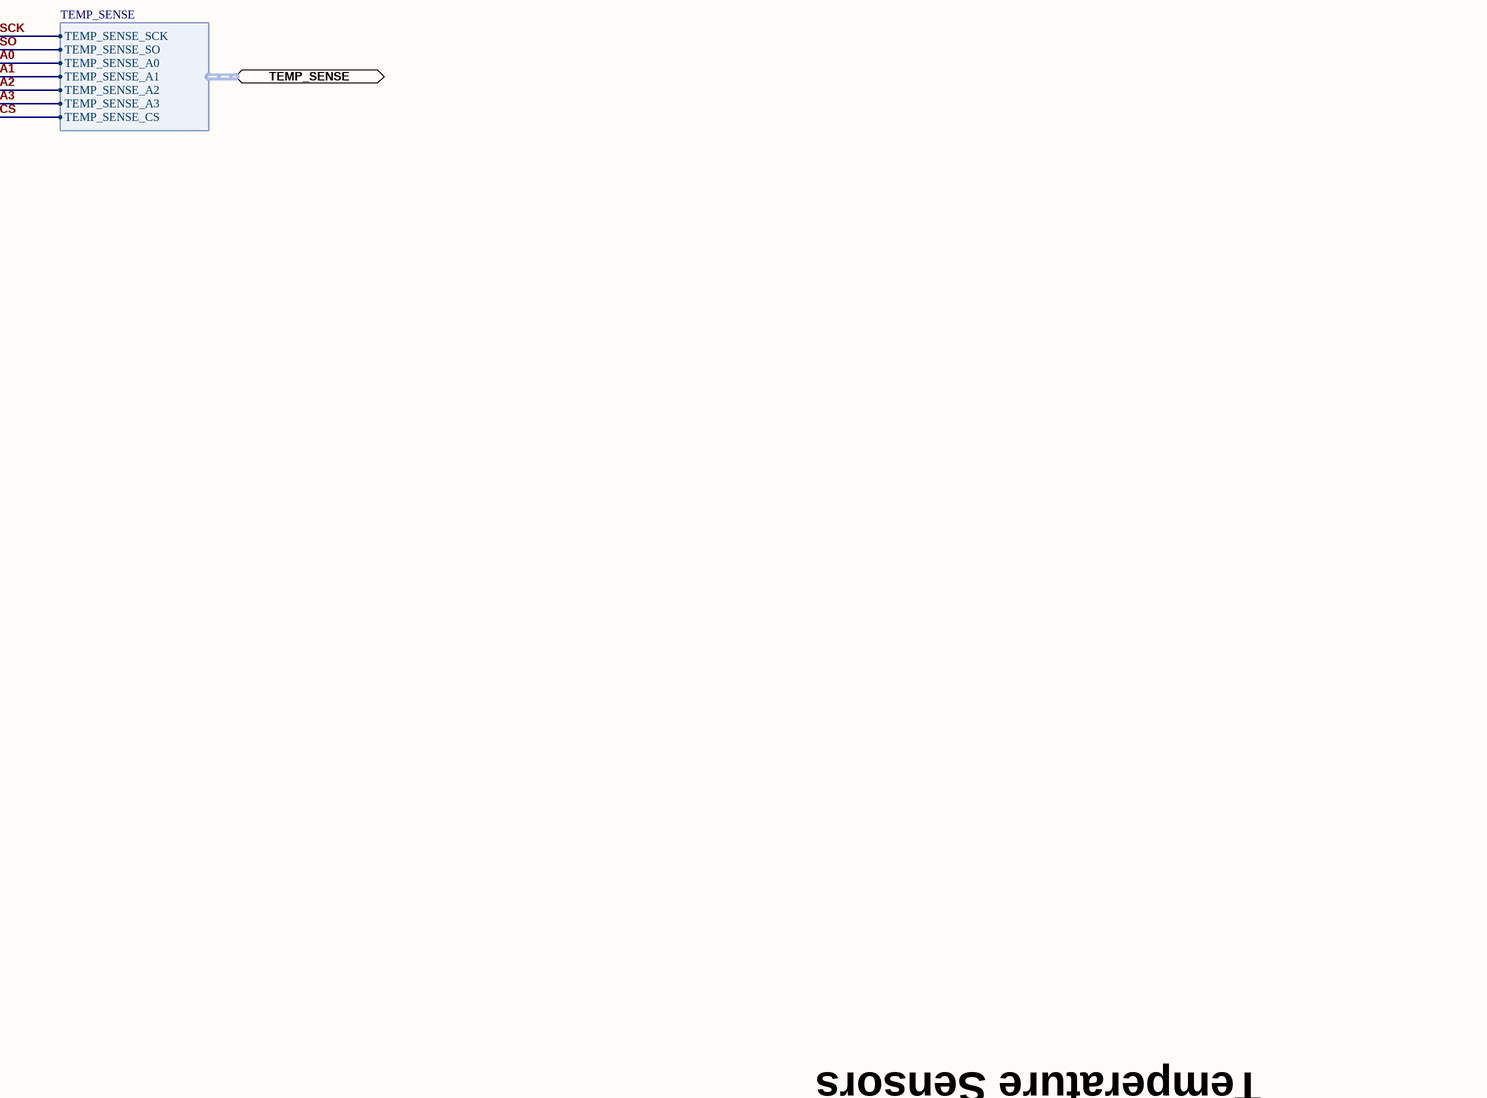
[diagram p20: TEMPERATURE_MEASUREMENT.SchDoc, bottom right]

### Parts
C1  0.1µF  50V  [C0805_LD]
C2  0.1µF  50V  [C0805_LD]
C3  0.1µF  50V  [C0805_LD]
C4  0.1µF  50V  [C0805_LD]
C5  0.1µF  50V  [C0805_LD]
C6  0.1µF  50V  [C0805_LD]
C7  0.1µF  50V  [C0805_LD]
C8  0.1µF  50V  [C0805_LD]
C9  0.1µF  50V  [C0805_LD]
C10  0.1µF  50V  [C0805_LD]
C11  0.1µF  50V  [C0805_LD]
C12  0.1µF  50V  [C0805_LD]
C13  0.1µF  50V  [C0805_LD]
C14  0.1µF  50V  [C0805_LD]
U11  MAX31855KASA+T  [SOIC 8]
U12  MAX31855KASA+T  [SOIC 8]
U13  MAX31855KASA+T  [SOIC 8]
U14  MAX31855KASA+T  [SOIC 8]
U15  MAX31855KASA+T  [SOIC 8]
U16  MAX31855KASA+T  [SOIC 8]
U17  MAX31855KASA+T  [SOIC 8]
U18  SN74HC138NSR  [SOIC 16 Wide]
U19  MAX31855KASA+T  [SOIC 8]
U20  MAX31855KASA+T  [SOIC 8]
U21  SN74HC138NSR  [SOIC 16 Wide]
U22  MAX31855KASA+T  [SOIC 8]
U23  MAX31855KASA+T  [SOIC 8]
U24  MAX31855KASA+T  [SOIC 8]

### Ports
TEMP_IO (harness TEMP_IO), TEMP_SENSE (harness TEMP_SENSE)

### Harnesses
TEMP_IO: TEMP-_0, TEMP+_0, TEMP+_1, TEMP-_1, TEMP+_2, TEMP-_2, TEMP+_3, TEMP-_3, TEMP+_4, TEMP-_4, TEMP+_5, TEMP-_5, TEMP+_6, TEMP-_6, TEMP+_7, TEMP-_7, TEMP+_8, TEMP-_8, TEMP+_9, TEMP-_9, TEMP+_10, TEMP-_10, TEMP+_11, TEMP-_11
TEMP_SENSE: TEMP_SENSE_SCK, TEMP_SENSE_SO, TEMP_SENSE_A0, TEMP_SENSE_A1, TEMP_SENSE_A2, TEMP_SENSE_A3, TEMP_SENSE_CS

### Nets
3.3V: U18.6(E3)
+3.3v: C1.2 C2.2 C3.2 C4.2 C5.2 C6.2 C7.2 C8.2 C9.2 C10.2 C11.2 C12.2 C13.2 C14.2 U11.4(VCC) U12.4(VCC) U13.4(VCC) U14.4(VCC) U15.4(VCC) U16.4(VCC) U17.4(VCC) U18.16(VCC) U19.4(VCC) U20.4(VCC) U21.16(VCC) U22.4(VCC) U23.4(VCC) U24.4(VCC)
GND: C1.1 C2.1 C3.1 C4.1 C5.1 C6.1 C7.1 C8.1 C9.1 C10.1 C11.1 C12.1 C13.1 C14.1 U11.1(GND) U12.1(GND) U13.1(GND) U14.1(GND) U15.1(GND) U16.1(GND) U17.1(GND) U18.8(GND) U19.1(GND) U20.1(GND) U21.5(~{E2}) U21.8(GND) U22.1(GND) U23.1(GND) U24.1(GND)
TEMP+_0: U11.3(T+) ; port TEMP_IO.TEMP+_0
TEMP+_1: U12.3(T+) ; port TEMP_IO.TEMP+_1
TEMP+_2: U13.3(T+) ; port TEMP_IO.TEMP+_2
TEMP+_3: U14.3(T+) ; port TEMP_IO.TEMP+_3
TEMP+_4: U15.3(T+) ; port TEMP_IO.TEMP+_4
TEMP+_5: U16.3(T+) ; port TEMP_IO.TEMP+_5
TEMP+_6: U17.3(T+) ; port TEMP_IO.TEMP+_6
TEMP+_7: U19.3(T+) ; port TEMP_IO.TEMP+_7
TEMP+_8: U20.3(T+) ; port TEMP_IO.TEMP+_8
TEMP+_9: U22.3(T+) ; port TEMP_IO.TEMP+_9
TEMP+_10: U23.3(T+) ; port TEMP_IO.TEMP+_10
TEMP+_11: U24.3(T+) ; port TEMP_IO.TEMP+_11
TEMP-_0: U11.2(T-) ; port TEMP_IO.TEMP-_0
TEMP-_1: U12.2(T-) ; port TEMP_IO.TEMP-_1
TEMP-_2: U13.2(T-) ; port TEMP_IO.TEMP-_2
TEMP-_3: U14.2(T-) ; port TEMP_IO.TEMP-_3
TEMP-_4: U15.2(T-) ; port TEMP_IO.TEMP-_4
TEMP-_5: U16.2(T-) ; port TEMP_IO.TEMP-_5
TEMP-_6: U17.2(T-) ; port TEMP_IO.TEMP-_6
TEMP-_7: U19.2(T-) ; port TEMP_IO.TEMP-_7
TEMP-_8: U20.2(T-) ; port TEMP_IO.TEMP-_8
TEMP-_9: U22.2(T-) ; port TEMP_IO.TEMP-_9
TEMP-_10: U23.2(T-) ; port TEMP_IO.TEMP-_10
TEMP-_11: U24.2(T-) ; port TEMP_IO.TEMP-_11
TEMP_SENSE_A0: U18.1(A0) U21.1(A0) ; port TEMP_SENSE.TEMP_SENSE_A0
TEMP_SENSE_A1: U18.2(A1) U21.2(A1) ; port TEMP_SENSE.TEMP_SENSE_A1
TEMP_SENSE_A2: U18.3(A2) U21.3(A2) ; port TEMP_SENSE.TEMP_SENSE_A2
TEMP_SENSE_A3: U18.4(~{E1}) U21.6(E3) ; port TEMP_SENSE.TEMP_SENSE_A3
TEMP_SENSE_CS: U18.5(~{E2}) U21.4(~{E1}) ; port TEMP_SENSE.TEMP_SENSE_CS
TEMP_SENSE_SCK: U11.5(SCK) U12.5(SCK) U13.5(SCK) U14.5(SCK) U15.5(SCK) U16.5(SCK) U17.5(SCK) U19.5(SCK) U20.5(SCK) U22.5(SCK) U23.5(SCK) U24.5(SCK) ; port TEMP_SENSE.TEMP_SENSE_SCK  [project net LCD_SCK]
TEMP_SENSE_SO: U11.7(SO) U12.7(SO) U13.7(SO) U14.7(SO) U15.7(SO) U16.7(SO) U17.7(SO) U19.7(SO) U20.7(SO) U22.7(SO) U23.7(SO) U24.7(SO) ; port TEMP_SENSE.TEMP_SENSE_SO  [project net MCU_MISO1]
NetU11_6: U11.6(~{CS}) U18.15(~{Y0})
NetU12_6: U12.6(~{CS}) U18.14(~{Y1})
NetU13_6: U13.6(~{CS}) U18.13(~{Y2})
NetU14_6: U14.6(~{CS}) U18.12(~{Y3})
NetU15_6: U15.6(~{CS}) U18.11(~{Y4})
NetU16_6: U16.6(~{CS}) U18.10(~{Y5})
NetU17_6: U17.6(~{CS}) U18.9(~{Y6})
NetU18_7: U18.7(~{Y7}) U19.6(~{CS})
NetU20_6: U20.6(~{CS}) U21.15(~{Y0})
NetU21_12: U21.12(~{Y3}) U24.6(~{CS})
NetU21_13: U21.13(~{Y2}) U23.6(~{CS})
NetU21_14: U21.14(~{Y1}) U22.6(~{CS})

Not connected (* = marked no-connect by the designer): U21 7(~{Y7}) 9(~{Y6}) 10(~{Y5}) 11(~{Y4})

### Notes on the sheet
- A 10nF capacitor (10000pF or .01uF)  needs to be placed across pins 2 and 3 the MAX31855 to file noise that may show up on thermocouples with long lead lengths
- Temperature Sensors
- -1
- Wavenumber LLC
- 2pl
- Rev:
- Sheet
- of

### Library data of the parts
C1-C14 = GRM21BR71H104KA01L: as C68 on sheet MCU; Value: 0.1µF  50V; Temperature Coefficient: X7R; Manufacturer Part Number: GRM21BR71H104KA01L; ComponentLink1Description: \\altium.sil.arl.psu.edu\Libraries\datasheets\Murata Electronics North America\c02e.pdf; ComponentLink1URL: http://search.murata.co.jp/Ceramy/image/img/A01X/G101/ENG/GRM1555C1HR60WA01-01.pdf; ComponentLink2Description: External Datasheet; ComponentLink2URL: http://www.murata.com/products/catalog/pdf/c02e.pdf; Stocked: 0; Supplier 1: Digi-Key; Supplier Part Number 1: 490-1666-1-ND; Category: Capacitors; Sort Value: 100000; Sort Value Package: 0805_100000; Pricing: 1 = 0.1  ;  10 = 0.046  ;  50 = 0.0248  ;  100 = 0.0209  ;  250 = 0.01712  ;  500 = 0.01464  ;  1000 = 0.0114 (USD); Sales Status: Active; Capacitance: 0.1µF; Voltage - Rated: 50V; Tolerance: ±10%; Mounting Type: Surface Mount- MLCC; Operating Temperature: -55°C ~ 125°C; Applications: General Purpose; Ratings: -; Package / Case: 0805 (2012 Metric); Size / Dimension: 0.079" L x 0.049" W (2.00mm x 1.25mm); Height - Seated (Max): -; Thickness (Max): 0.053" (1.35mm); Lead Spacing: -; Features: -; Packaging: Cut Tape (CT); Lead Style: -; Package: 0805; Thickness: 135
U11-U17 U19 U20 U22-U24 = MAX31855KASA+T: IC CONV THERMOCOUPLE-DGTL 8SOIC; Manufacturer: Maxim Integrated; Function: Thermocouple Cold Junction Compensator; Sensor Type: External; Sensing Temperature: -200°C ~ 1350°C; Accuracy: ±6°C(Max); Topology: ADC; Output Type: 3-Wire/SPI™ Serial; Output Alarm: No; Voltage - Supply: 3 V ~ 3.6 V; Supplier 1: Digi-Key; RoHS: RoHS Compliant; Category: Integrated Circuits (ICs); Stock 1: 2436; Pricing 1: 1=7.38, 25=5.5692, 100=4.8731, 500=4.45536 (USD); Packaging: Cut Tape (CT); Output Fan: No; Operating Temperature: -40°C ~ 125°C; Mounting Type: Surface Mount; Package / Case: 8-SOIC (0.154", 3.90mm Width); Supplier Device Package: 8-SOIC N; ComponentLink1URL: http://datasheets.maximintegrated.com/en/ds/MAX31855.pdf; ComponentLink1Description: http://datasheets.maximintegrated.com/en/ds/MAX31855.pdf; Supplier Part Number 1: MAX31855KASA+TCT-ND; Value: MAX31855KASA+T; Manufacturer Part Number: MAX31855KASA+T
U18 U21 = SN74HC138NSR: IC DECODER/DEMUX 3-8 LINE 16SO; Manufacturer: Texas Instruments; Circuit: 1 x 3:8; Independent Circuits: 1; Current - Output High, Low: 5.2mA, 5.2mA; Voltage Supply Source: Single Supply; Voltage - Supply: 2 V ~ 6 V; Supplier 1: Digi-Key; RoHS: RoHS Compliant; Category: Integrated Circuits (ICs); Stock 1: 3936; Pricing 1: 1=0.44, 10=0.371, 25=0.3248, 100=0.2781, 250=0.2412, 500=0.2043, 1000=0.1575 (USD); Packaging: Cut Tape (CT); Type: Decoder/Demultiplexer; Operating Temperature: -40°C ~ 85°C; Mounting Type: Surface Mount; Package / Case: 16-SOIC (0.209", 5.30mm Width); Supplier Device Package: 16-SO; ComponentLink1URL: http://www.ti.com/lit/ds/symlink/sn74hc138.pdf; ComponentLink1Description: http://www.ti.com/lit/ds/symlink/sn74hc138.pdf; Supplier Part Number 1: 296-12886-1-ND; Manufacturer Part Number: SN74HC138NSR; Value: SN74HC138NSR